# EAGLE design PDB_MH (EAGLE 7.4.0)
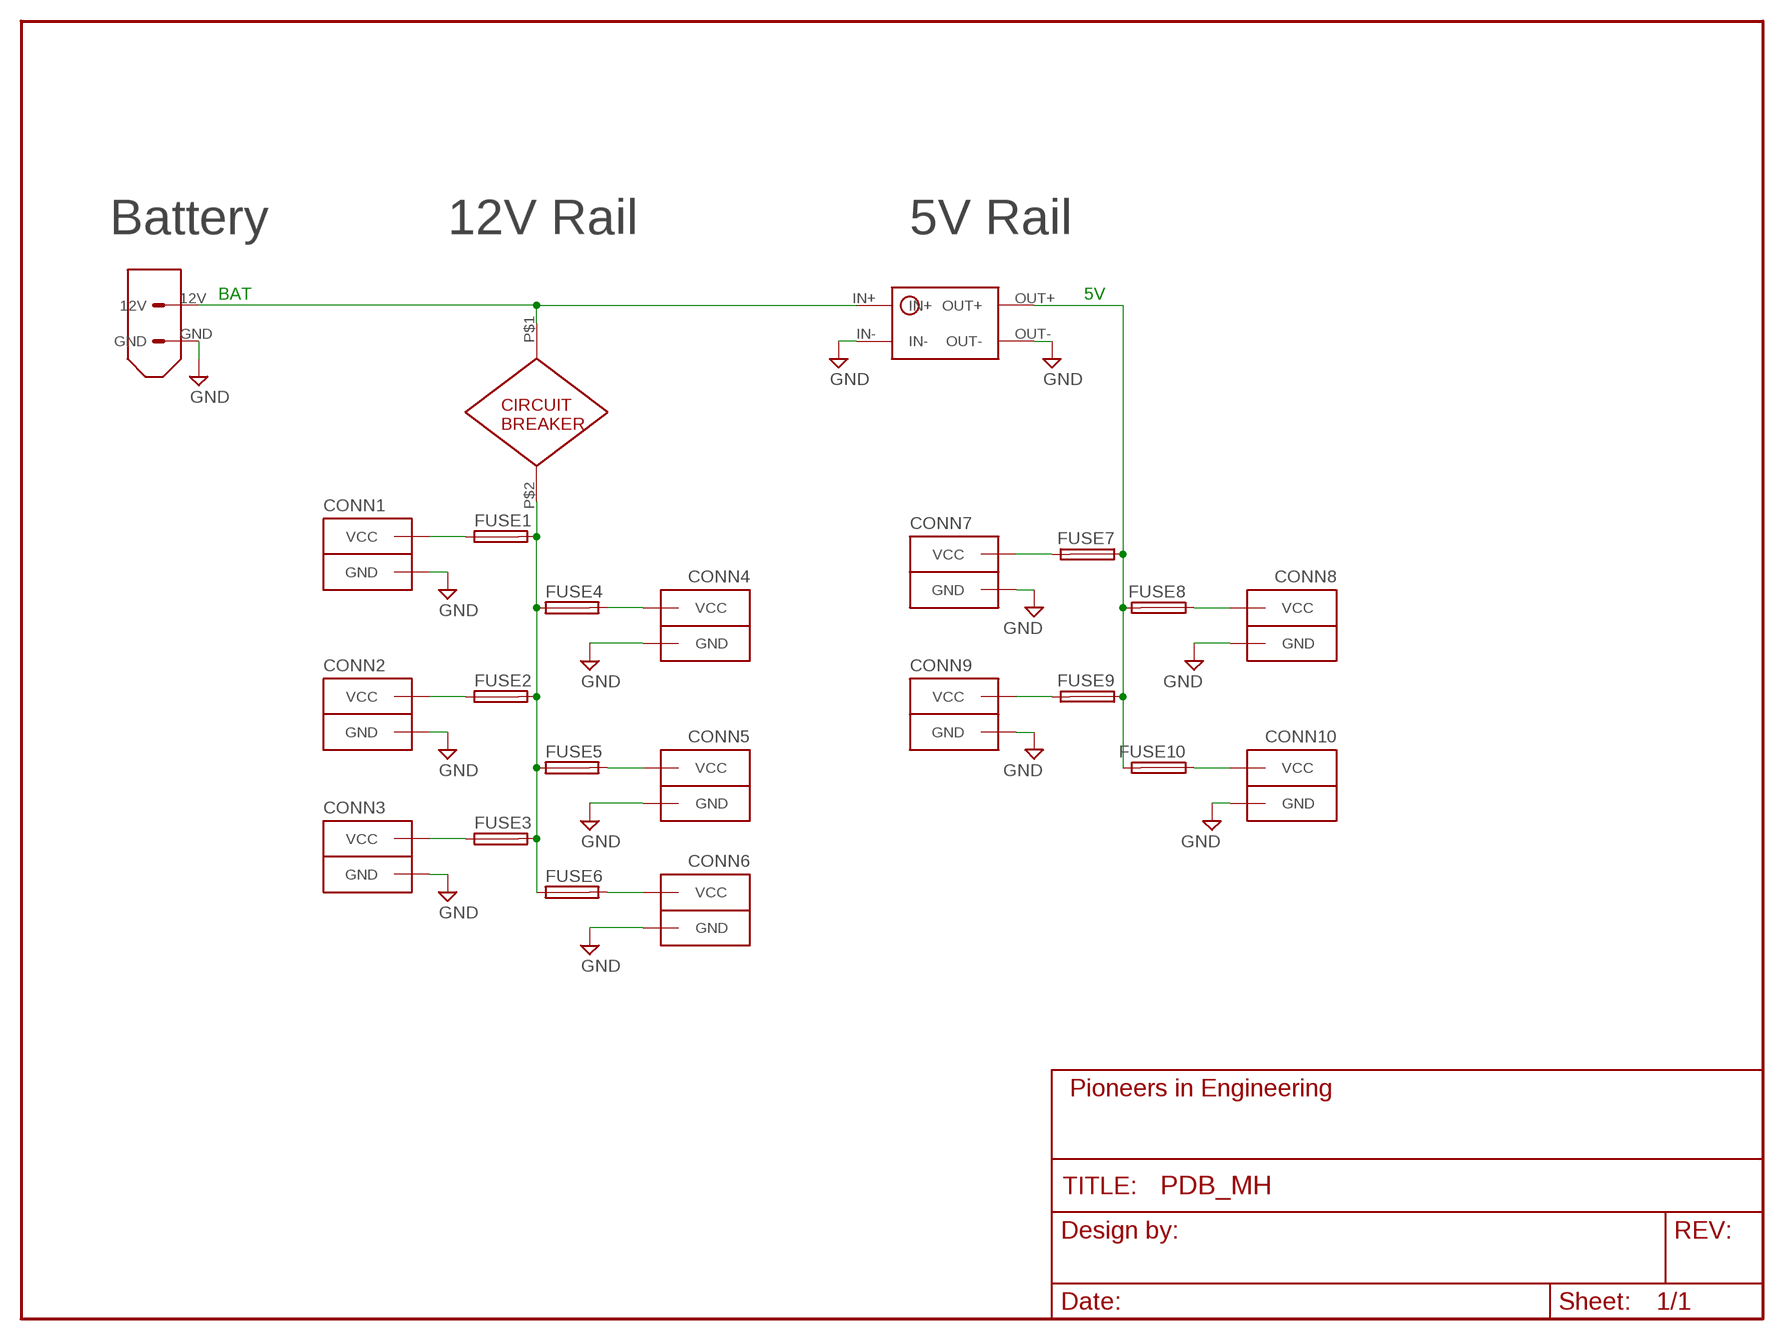
[diagram p0: schematic, sheet 1]
FRAME1 (FRAME-LETTER): AUTHOR: Mohammed H., Sharabesh R., Tobin H.; REVISION: B

## Parts
CIRCUIT_BREAKER  CIRC_BREAKER  [CIRC_BREAKER]
CONN1  ANDERSONVERTICAL  [ANDERSON_VERTICAL]
CONN2  ANDERSONVERTICAL  [ANDERSON_VERTICAL]
CONN3  ANDERSONVERTICAL  [ANDERSON_VERTICAL]
CONN4  ANDERSONVERTICAL  [ANDERSON_VERTICAL]
CONN5  ANDERSONVERTICAL  [ANDERSON_VERTICAL]
CONN6  ANDERSONVERTICAL  [ANDERSON_VERTICAL]
CONN7  ANDERSONVERTICAL  [ANDERSON_VERTICAL]
CONN8  ANDERSONVERTICAL  [ANDERSON_VERTICAL]
CONN9  ANDERSONVERTICAL  [ANDERSON_VERTICAL]
CONN10  ANDERSONVERTICAL  [ANDERSON_VERTICAL]
FUSE1  FUSE_HOLDER_SMD  [FUSE_HOLDER_SMD]
FUSE2  FUSE_HOLDER_SMD  [FUSE_HOLDER_SMD]
FUSE3  FUSE_HOLDER_SMD  [FUSE_HOLDER_SMD]
FUSE4  FUSE_HOLDER_SMD  [FUSE_HOLDER_SMD]
FUSE5  FUSE_HOLDER_SMD  [FUSE_HOLDER_SMD]
FUSE6  FUSE_HOLDER_SMD  [FUSE_HOLDER_SMD]
FUSE7  FUSE_HOLDER_SMD  [FUSE_HOLDER_SMD]
FUSE8  FUSE_HOLDER_SMD  [FUSE_HOLDER_SMD]
FUSE9  FUSE_HOLDER_SMD  [FUSE_HOLDER_SMD]
FUSE10  FUSE_HOLDER_SMD  [FUSE_HOLDER_SMD]
U$1  XT60CONNECTOR  [XT60CONNECTOR]
U$7  BUCK_CONVERTER_5V  [BUCK_CONVERTER_5V]

## Nets
5V: FUSE7.P$1_DOWN FUSE7.P$1_UP FUSE8.P$2_DOWN FUSE8.P$2_UP FUSE9.P$1_DOWN FUSE9.P$1_UP FUSE10.P$2_DOWN FUSE10.P$2_UP U$7.OUT+
12V: CIRCUIT_BREAKER.P$2 FUSE1.P$2_DOWN FUSE1.P$2_UP FUSE2.P$2_DOWN FUSE2.P$2_UP FUSE3.P$2_DOWN FUSE3.P$2_UP FUSE4.P$1_DOWN FUSE4.P$1_UP FUSE5.P$1_DOWN FUSE5.P$1_UP FUSE6.P$1_DOWN FUSE6.P$1_UP
BAT: CIRCUIT_BREAKER.P$1 U$1.12V U$7.IN+
GND: CONN1.PIN1(GND) CONN2.PIN1(GND) CONN3.PIN1(GND) CONN4.PIN1(GND) CONN5.PIN1(GND) CONN6.PIN1(GND) CONN7.PIN1(GND) CONN8.PIN1(GND) CONN9.PIN1(GND) CONN10.PIN1(GND) U$1.GND U$7.IN- U$7.OUT-
VOUT1: CONN1.PIN2(VCC) FUSE1.P$1_DOWN FUSE1.P$1_UP
VOUT2: CONN2.PIN2(VCC) FUSE2.P$1_DOWN FUSE2.P$1_UP
VOUT3: CONN3.PIN2(VCC) FUSE3.P$1_DOWN FUSE3.P$1_UP
VOUT4: CONN4.PIN2(VCC) FUSE4.P$2_DOWN FUSE4.P$2_UP
VOUT5: CONN5.PIN2(VCC) FUSE5.P$2_DOWN FUSE5.P$2_UP
VOUT6: CONN6.PIN2(VCC) FUSE6.P$2_DOWN FUSE6.P$2_UP
VOUT7: CONN7.PIN2(VCC) FUSE7.P$2_DOWN FUSE7.P$2_UP
VOUT8: CONN8.PIN2(VCC) FUSE8.P$1_DOWN FUSE8.P$1_UP
VOUT9: CONN9.PIN2(VCC) FUSE9.P$2_DOWN FUSE9.P$2_UP
VOUT10: CONN10.PIN2(VCC) FUSE10.P$1_DOWN FUSE10.P$1_UP

## Notes on the sheet
- Battery | 12V Rail | 5V Rail

## Library data of the parts
CIRCUIT_BREAKER = pie:CIRC_BREAKER: PiE Circuit Breaker: product page <http://www.waytekwire.com/item/46977/Bussmann-25550-B-2-Mid-Range-Circuit-Breaker-/>; MANUF: WAYTEK; MANUF-PN: 46977
CONN1-CONN10 = pie:ANDERSON: 2-pin 25A Anderson Connector http://www.alliedelec.com/images/products/datasheets/bm/ANDERSON_POWER_PRODUCTS/70162018.pdf; PIE-INT-REF-NUM: Anderson
FUSE1-FUSE10 = pie:FUSE_HOLDER_SMD: ATC/ATO Fuse Holder. Original variant datasheet <http://keyelco.com/userAssets/file/M65p43.pdf> and Digikey <http://www.digikey.com/product-detail/en/keystone-electronics/3587/36-3587-ND/2137315>; DIGIKEY-PN: 36-3587-ND; MANUF: KEYSTONE; MANUF-PN: 3587
U$1 = pie:XT60CONNECTOR: 12V XT60 power connector; PARTNUMBER: PRT-10474
U$7 = pie:BUCK_CONVERTER_5V: 5V Buck Converter. For PDB. Product Detail <https://www.amazon.com/dp/B00GQ032DK/?psc=1>

## Board
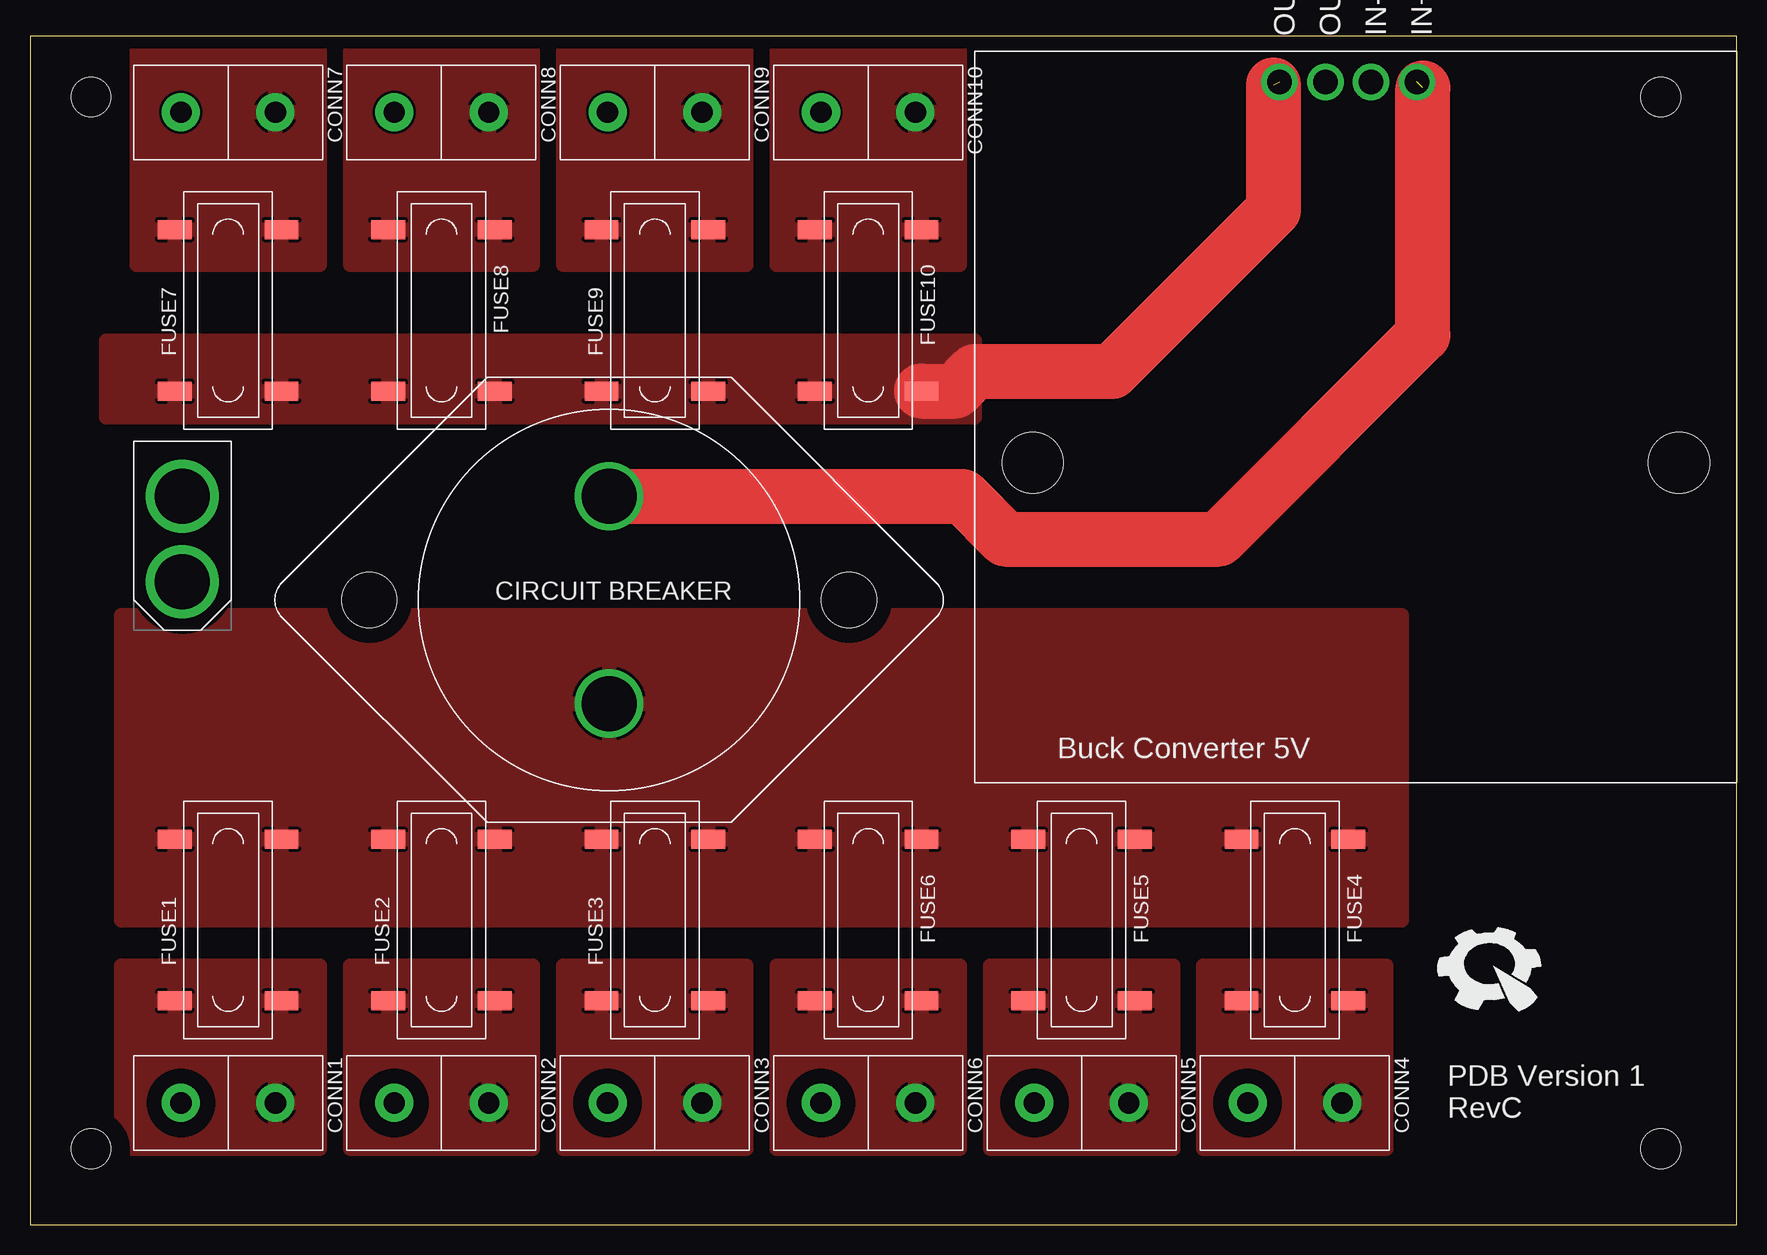
[diagram p1: board, top side]
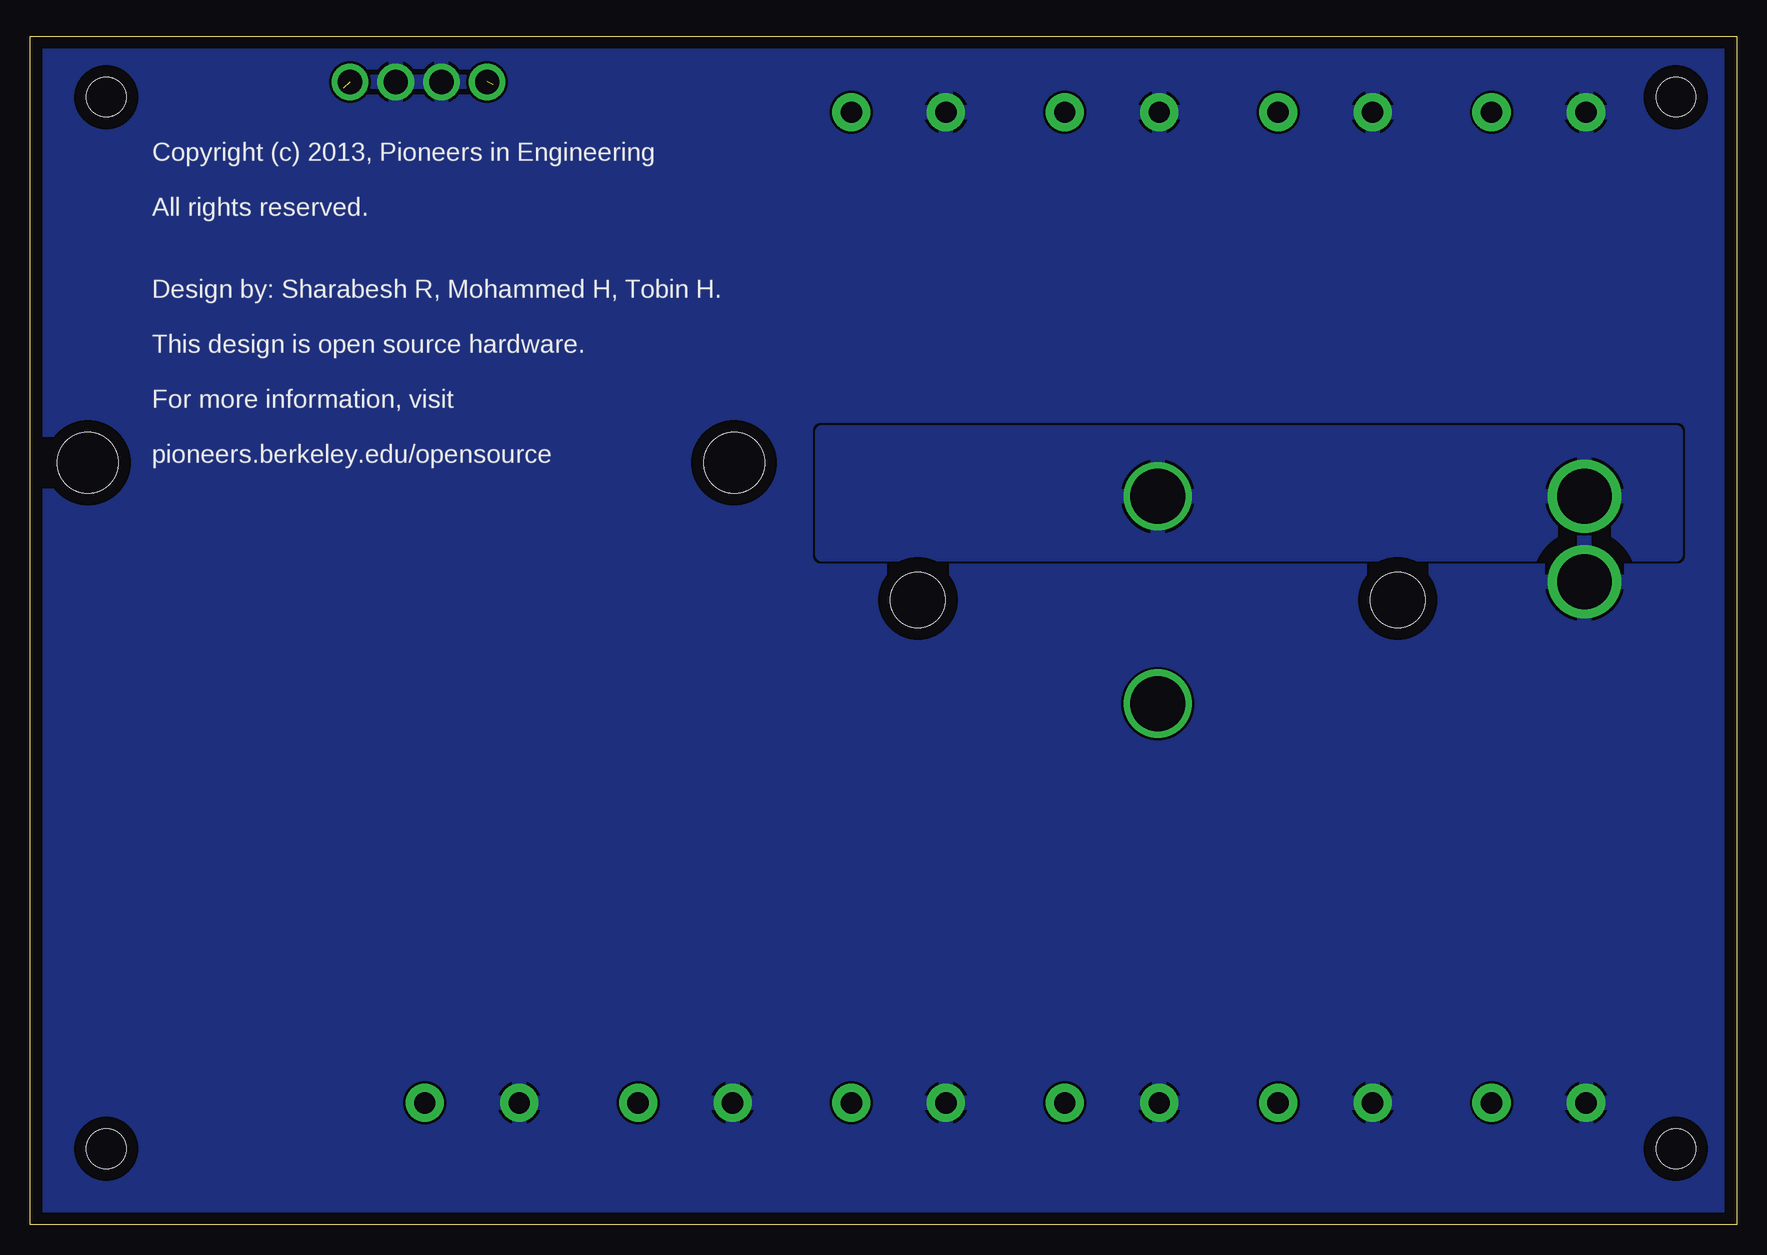
[diagram p2: board, bottom side, seen from below]

Size 142.24 x 99.06 mm. Coordinates in mm from the lower left corner, seen from the top.
Outline: 0,0 142.24,0 142.24,99.06 0,99.06 0,0
Copper layers (1*16): Top 0.035mm / dielectric 1.5mm / Bottom 0.035mm
Design rules "default": minimum track width 10mil, minimum drill 24mil, track to track 8mil, track to pad 8mil, pad to pad 8mil, via to via 8mil, smd to smd 8mil, copper to edge 40mil, drill to drill 8mil, minimum pad ring 10mil, minimum via ring 8mil, stop-mask expansion 4mil, vias tented up to drill 0mil, thermal gap 10mil

### Footprints (pad centres in the part's own frame; a part is rotated, then mirrored left to right if it is on the bottom)
CIRC_BREAKER = drill 4.572 pad 5.69: P$1 0,8.636; P$2 0,-8.636 | hole 4.572: -19.99,0; 19.99,0
ANDERSON_VERTICAL = drill 1.778 pad 3.175: PIN1 0,-3.937; PIN2 0,3.937
FUSE_HOLDER_SMD = smd 1.575 x 2.819: P$1_DOWN -6.731,-4.445; P$1_UP -6.731,4.445; P$2_DOWN 6.731,-4.445; P$2_UP 6.731,4.445
XT60CONNECTOR = drill 4.572 pad 6.096: 12V -3.556,0; GND 3.556,0
STAND-OFF = hole 3.302: 0,0
BUCK_CONVERTER_5V = drill 2.032 pad 3.048: IN+ 5.08,31.75; IN- 1.27,31.75; OUT+ -6.35,31.75; OUT- -2.54,31.75 | hole 5.08: -26.924,0; 26.924,0

### Placement (x,y rotation side)
CIRCUIT_BREAKER  48.26,52.07 0 top
CONN1  16.51,10.16 270 top
CONN2  34.29,10.16 270 top
CONN3  52.07,10.16 270 top
CONN4  105.41,10.16 270 top
CONN5  87.63,10.16 270 top
CONN6  69.85,10.16 270 top
CONN7  16.51,92.71 270 top
CONN8  34.29,92.71 270 top
CONN9  52.07,92.71 270 top
CONN10  69.85,92.71 270 top
FUSE1  16.51,25.4 90 top
FUSE2  34.29,25.4 90 top
FUSE3  52.07,25.4 90 top
FUSE4  105.41,25.4 270 top
FUSE5  87.63,25.4 270 top
FUSE6  69.85,25.4 270 top
FUSE7  16.51,76.2 90 top
FUSE8  34.29,76.2 270 top
FUSE9  52.07,76.2 90 top
FUSE10  69.85,76.2 270 top
U$1  12.7,57.15 270 top
U$2  [STAND-OFF]  5.08,6.35 0 top
U$3  [STAND-OFF]  5.08,93.98 0 bottom
U$4  [STAND-OFF]  135.89,93.98 90 top
U$5  [STAND-OFF]  135.89,6.35 0 top
U$6  [PIE-LOGO-SMALL]  121.92,21.59 0 top
U$7  110.49,63.5 0 top

### Tracks (layer width: path | path; a pad name or v marks a point on that pad's centre or on a via)
5V  (1 unrouted)
  Top 4.572: FUSE10.P$2_UP 77.09,69.47 78.74,71.12 90.17,71.12 103.63,84.58 103.63,95
  pour Top: 6.35,73.66 78.74,73.66 78.74,67.31 6.35,67.31
12V
  pour Top (isolate 1.27, rank 2): 7.62,50.8 114.3,50.8 114.3,25.4 7.62,25.4
BAT  (1 unrouted)
  Top 4.572: CIRCUIT_BREAKER.P$1 77.72,60.71 81.28,57.15 99.06,57.15 116.08,74.17 116.08,94.74
  pour Bottom (isolate 1.27, rank 3): 5.08,66.04 76.2,66.04 76.2,55.88 5.08,55.88
GND
  pour Bottom (rank 6): 0,99.06 142.24,99.06 142.24,0 0,0
VOUT1
  pour Top (isolate 1.27): 7.62,21.59 24.13,21.59 24.13,6.35 7.62,6.35
VOUT2
  pour Top (isolate 1.27): 26.67,21.59 41.91,21.59 41.91,6.35 26.67,6.35
VOUT3
  pour Top (isolate 1.27): 44.45,21.59 59.69,21.59 59.69,6.35 44.45,6.35
VOUT4
  pour Top (isolate 1.27): 97.79,6.35 113.03,6.35 113.03,21.59 97.79,21.59
VOUT5
  pour Top (isolate 1.27): 80.01,6.35 95.25,6.35 95.25,21.59 80.01,21.59
VOUT6
  pour Top (isolate 1.27): 62.23,6.35 77.47,6.35 77.47,21.59 62.23,21.59
VOUT7
  pour Top: 8.89,97.79 24.13,97.79 24.13,80.01 8.89,80.01
VOUT8
  pour Top: 26.67,97.79 26.67,80.01 41.91,80.01 41.91,97.79
VOUT9
  pour Top: 44.45,97.79 44.45,80.01 59.69,80.01 59.69,97.79
VOUT10
  pour Top: 62.23,97.79 62.23,80.01 77.47,80.01 77.47,97.79

### Text on the board
tPlace: PDB Version 1 / RevC
bPlace: Copyright (c) 2013, Pioneers in Engineering / / All rights reserved. / / / Design by: Sharabesh R, Mohammed H, Tobin H. / / This design is open source hardware. / / For more information, visit / / pioneers.berkeley.edu/opensource